# EAGLE schematic p8x-alu-card (EAGLE 9.6.2)
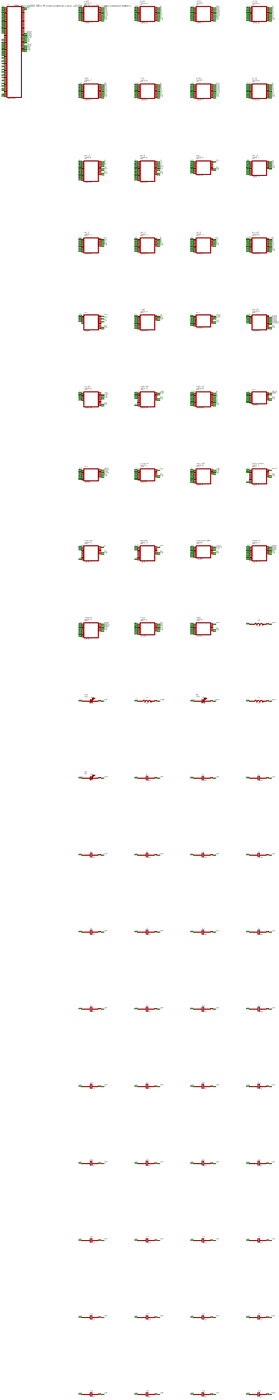
[diagram p0: schematic, sheet 1, overview]
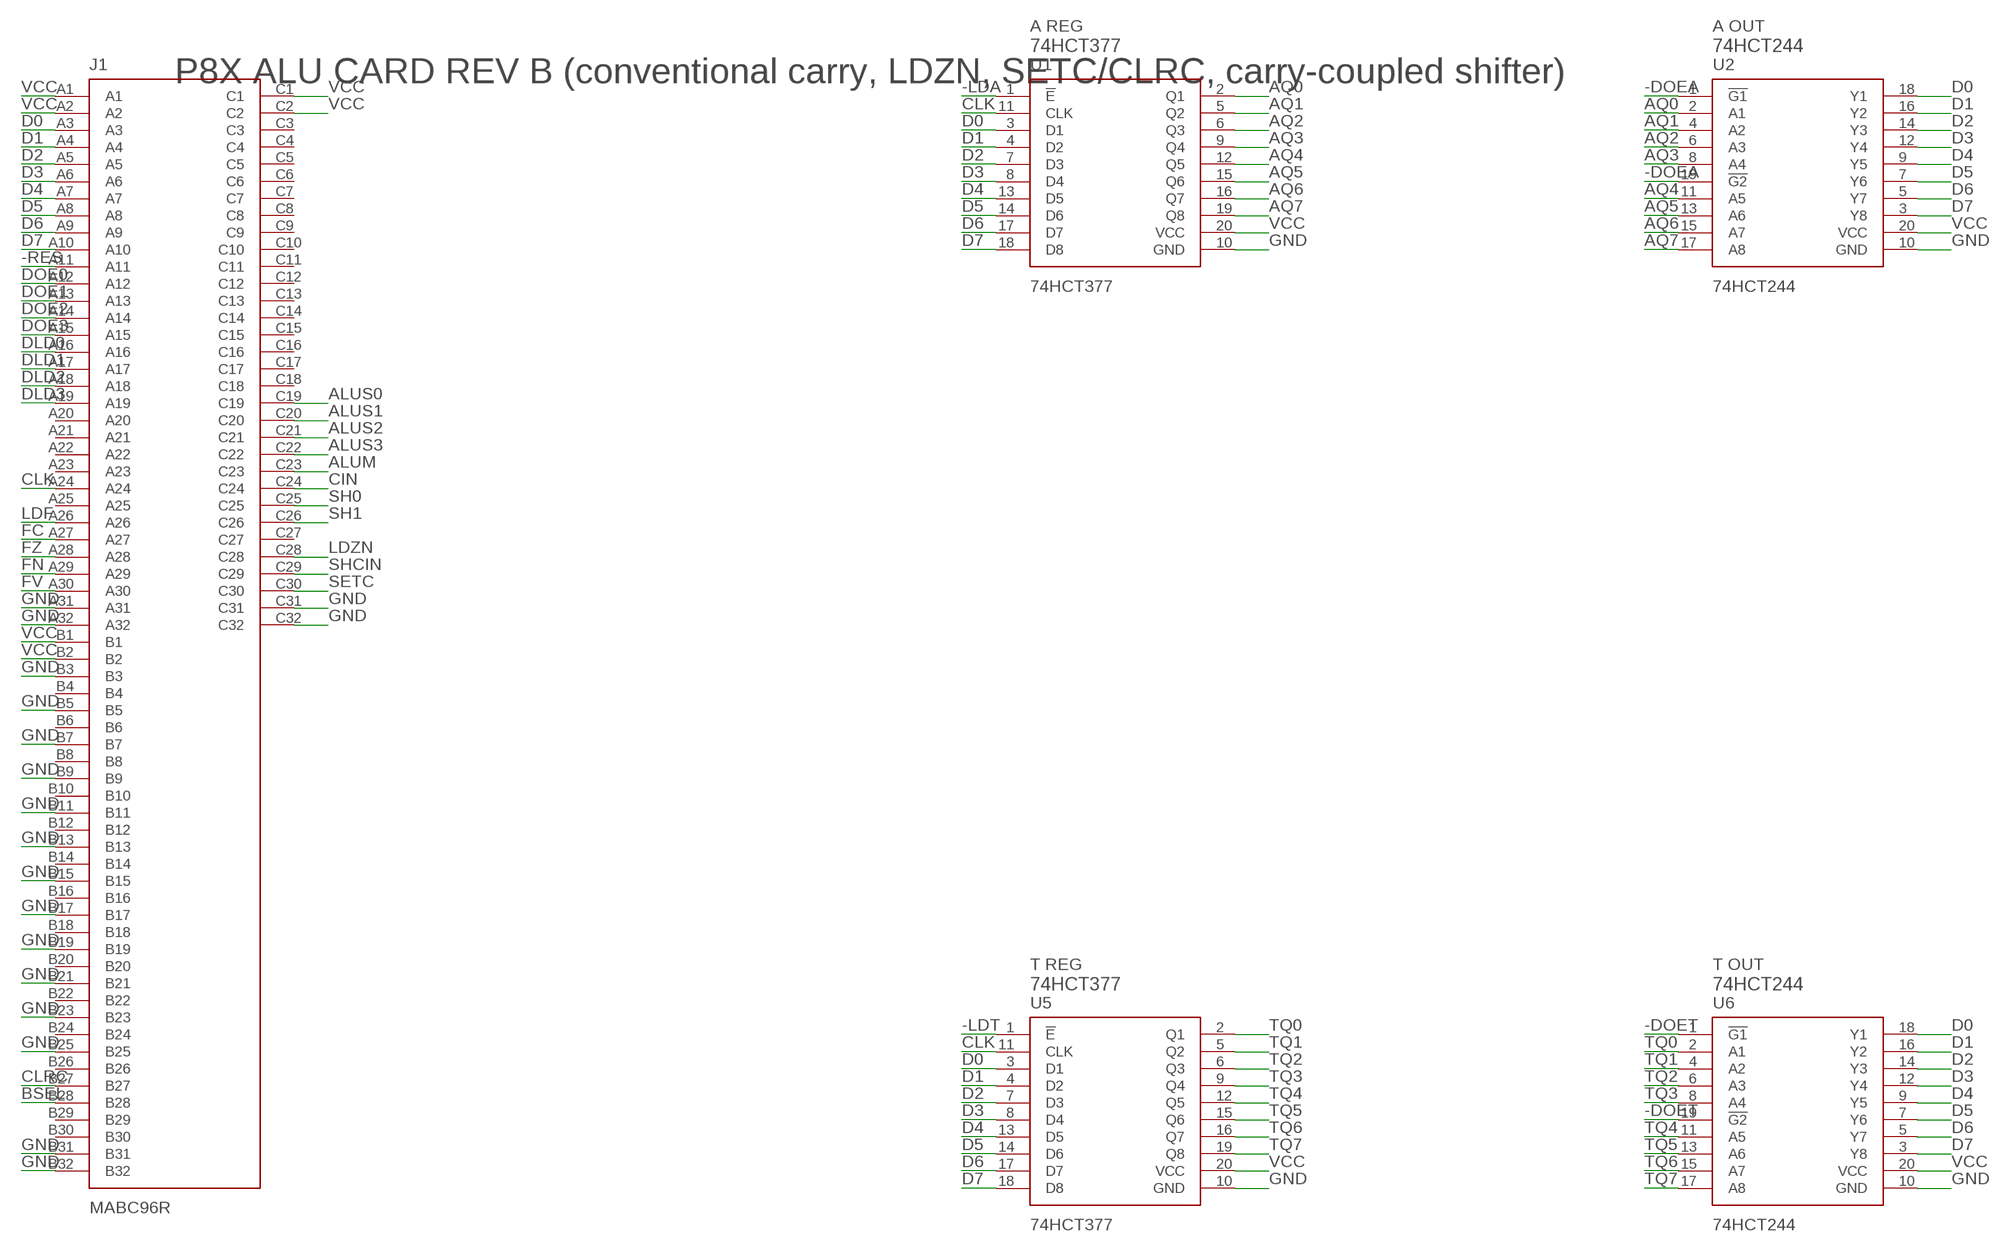
[diagram p1: schematic, sheet 1, part 1 of 8]
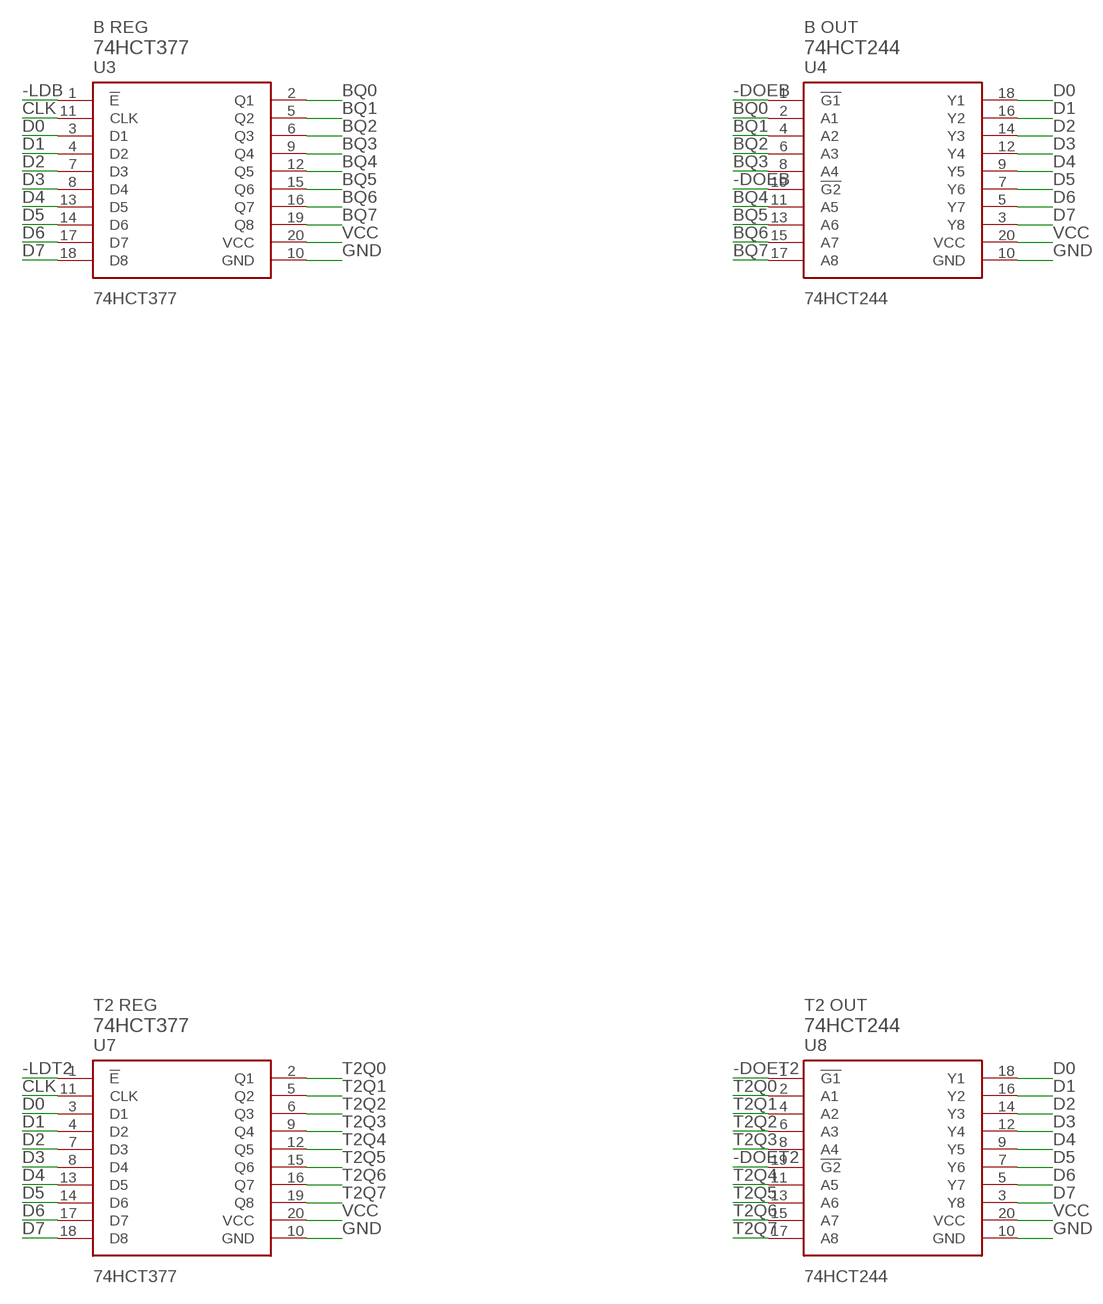
[diagram p2: schematic, sheet 1, part 2 of 8]
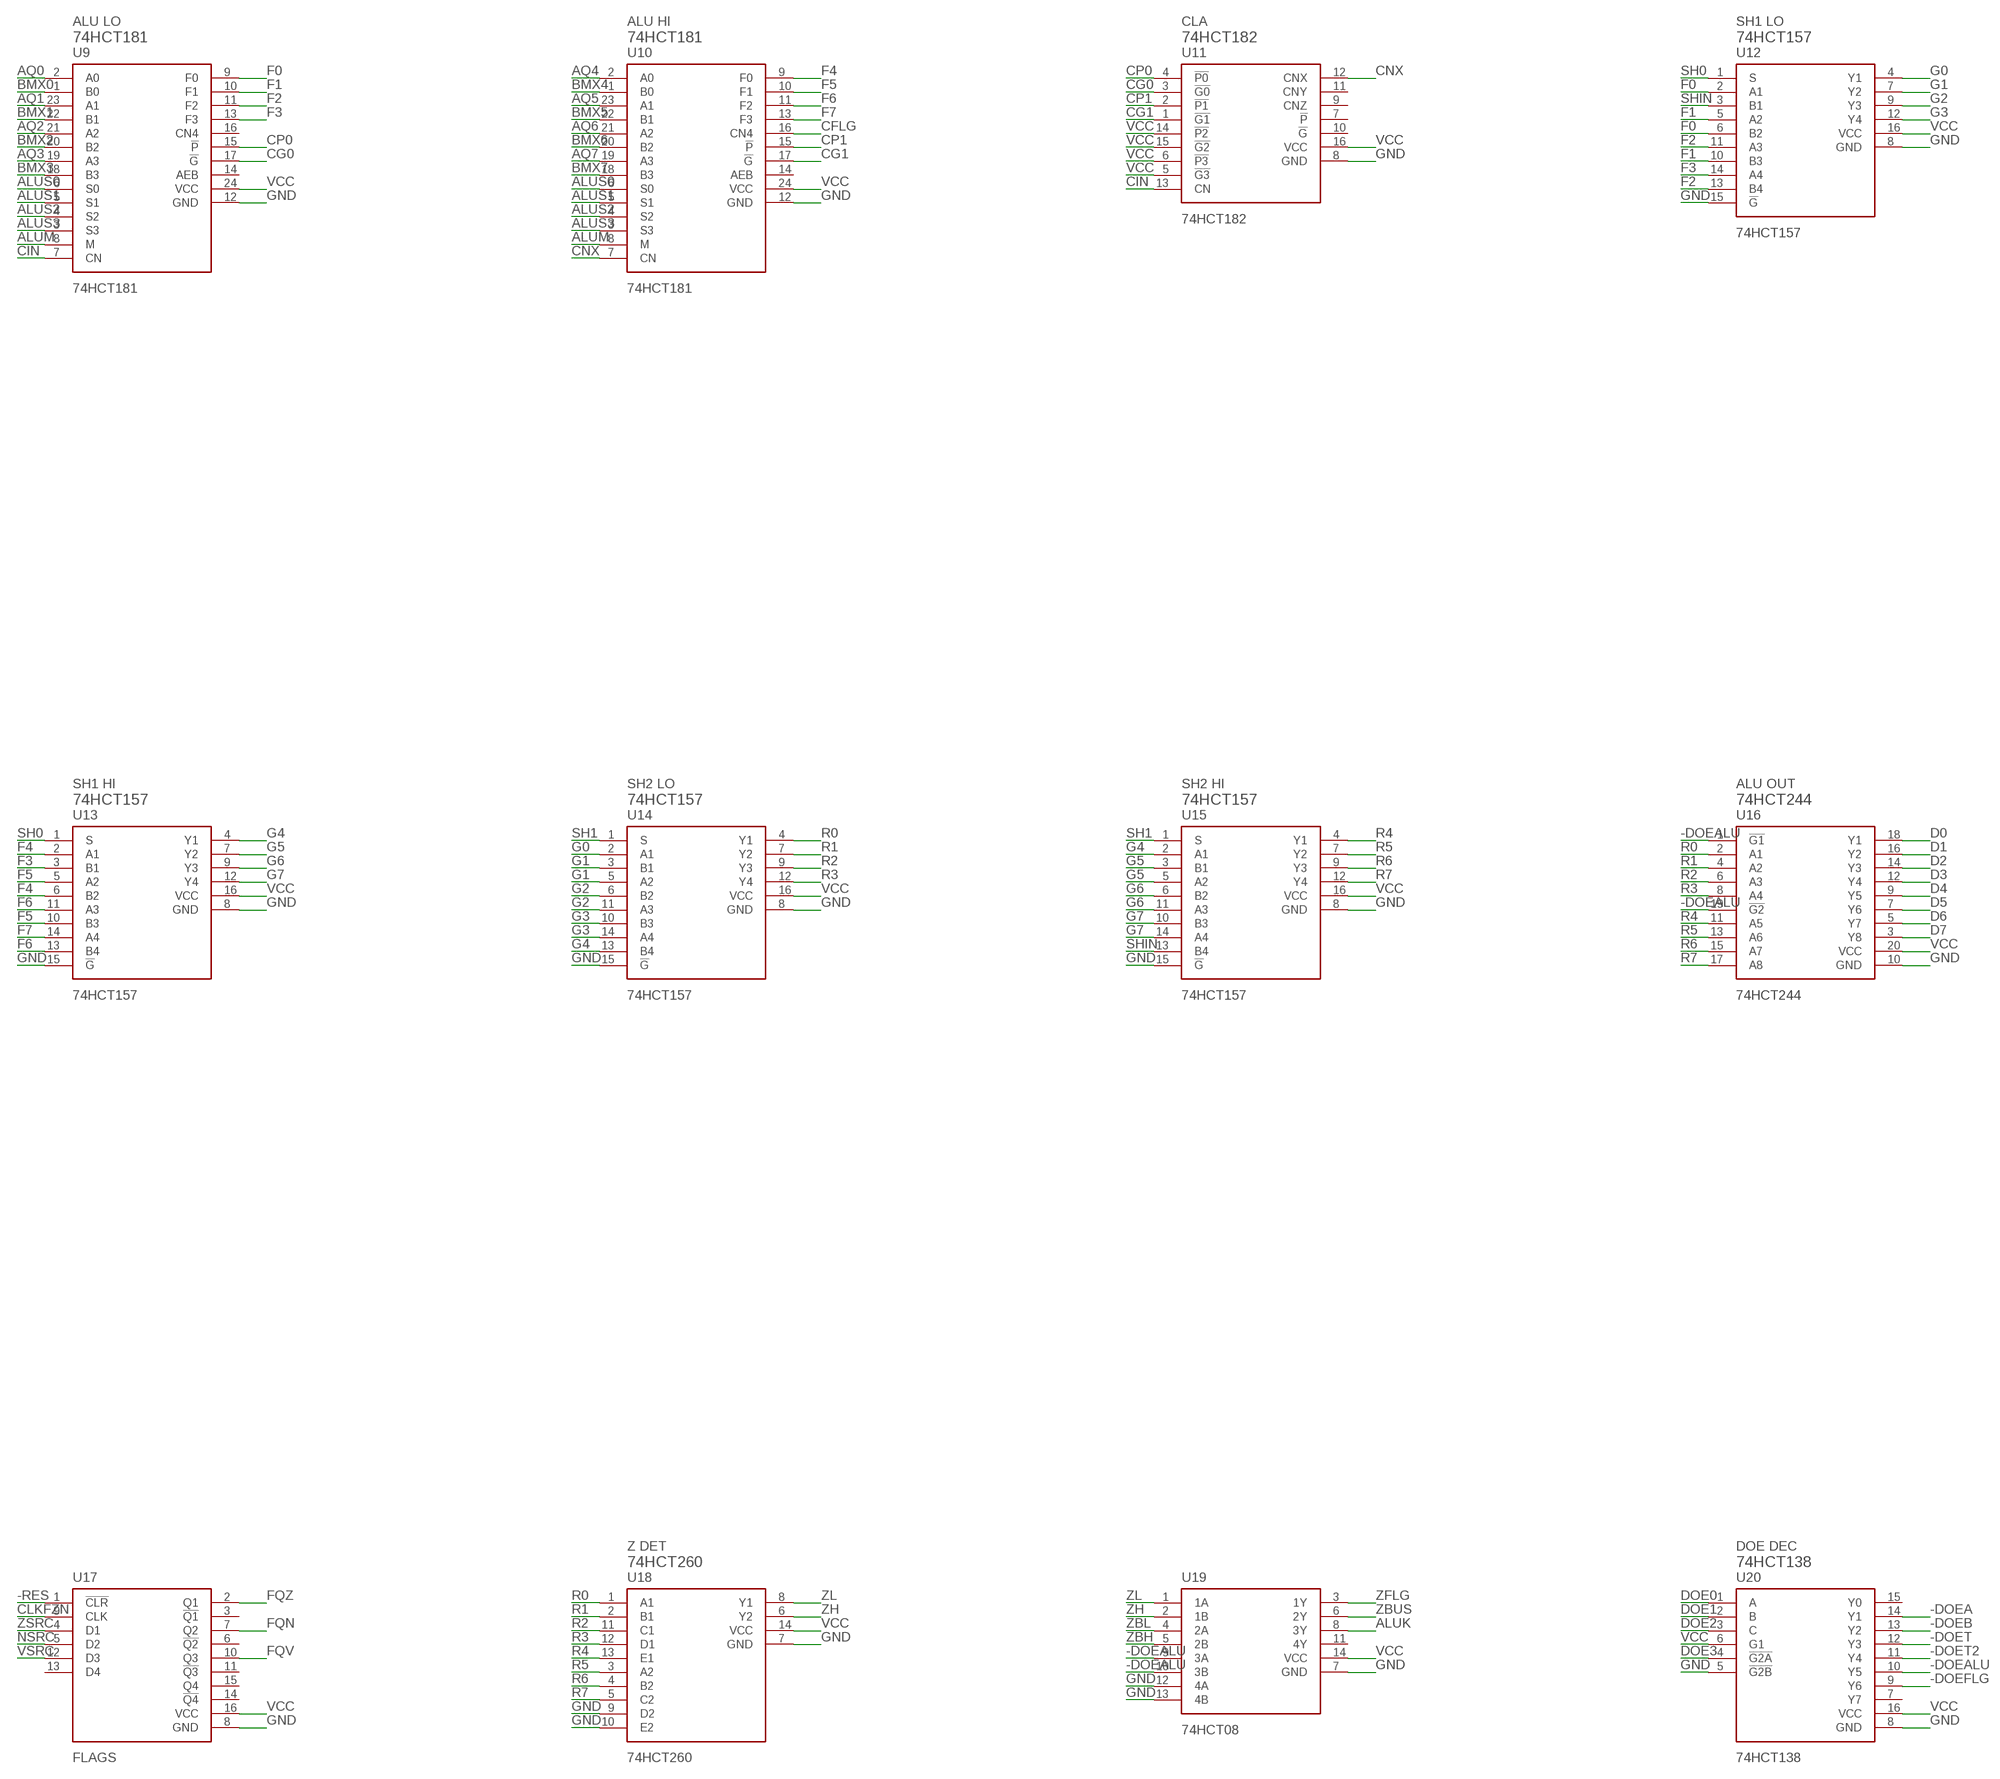
[diagram p3: schematic, sheet 1, part 3 of 8]
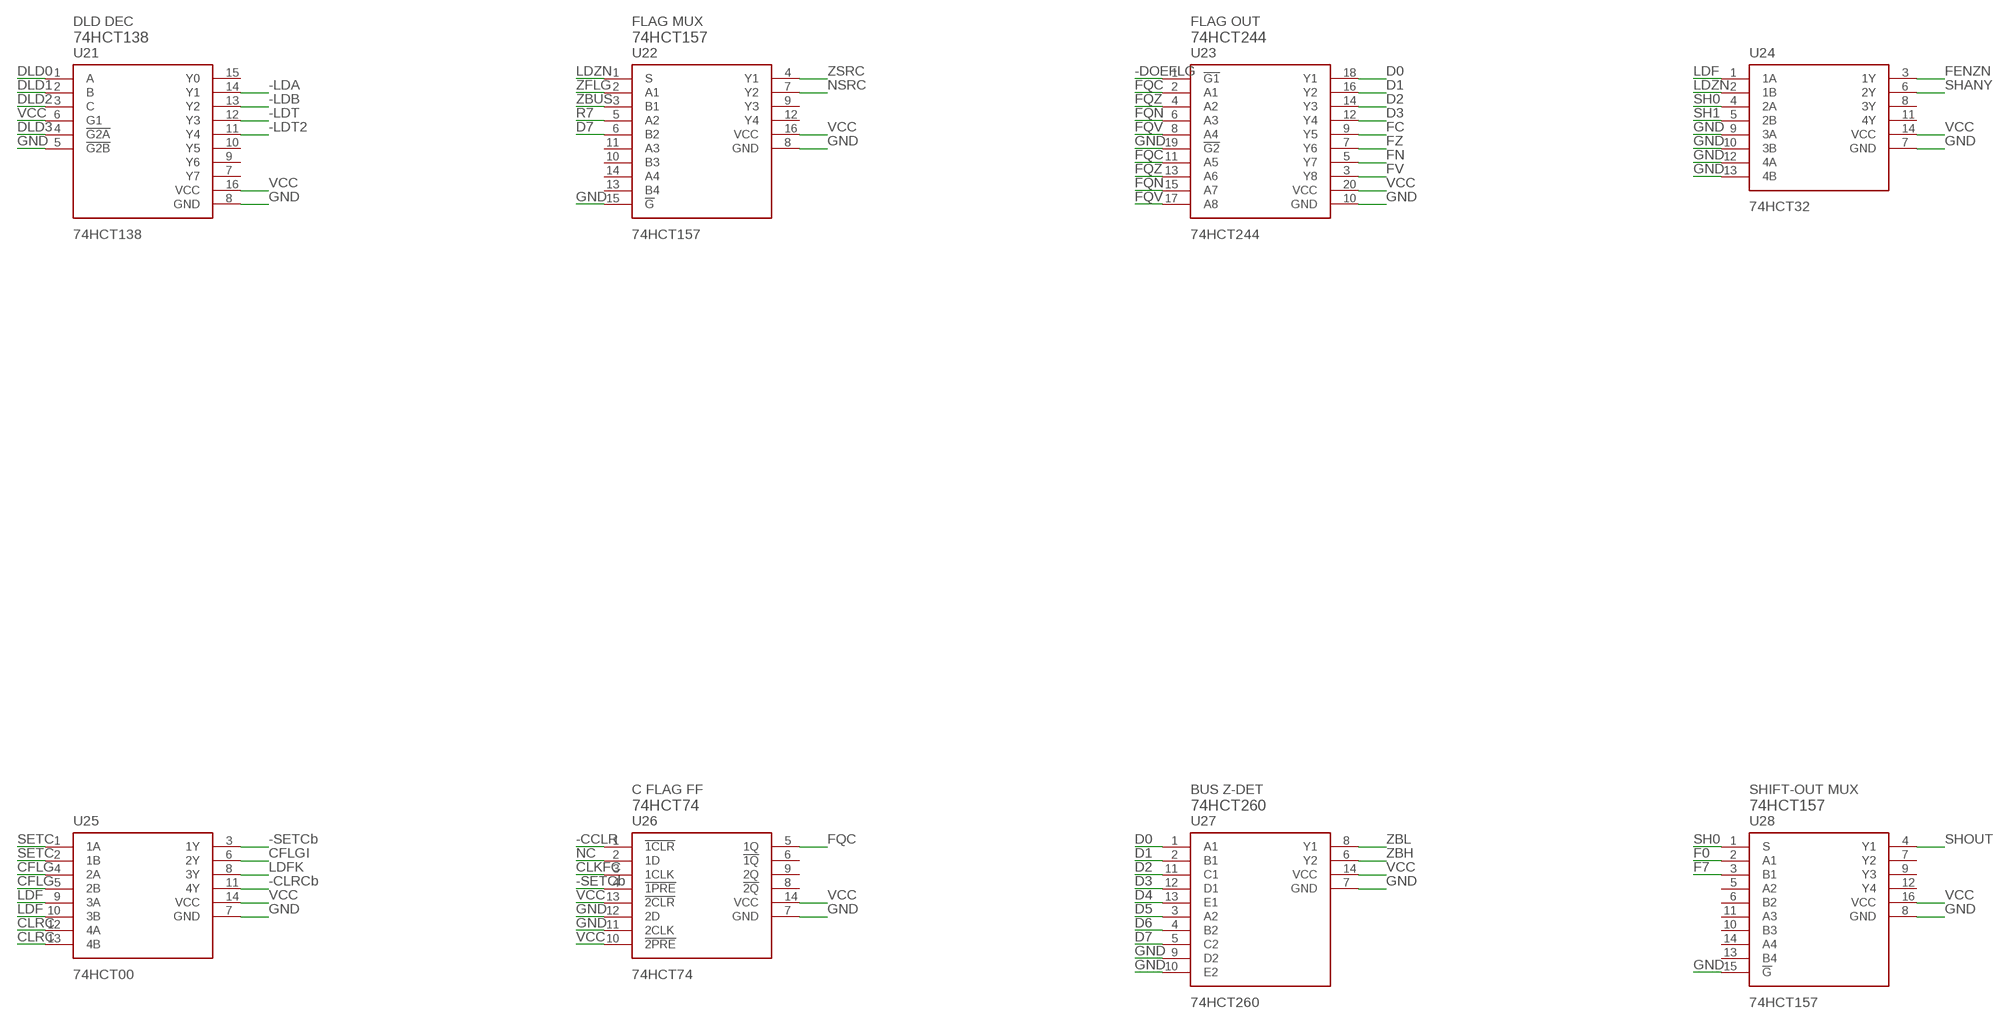
[diagram p4: schematic, sheet 1, part 4 of 8]
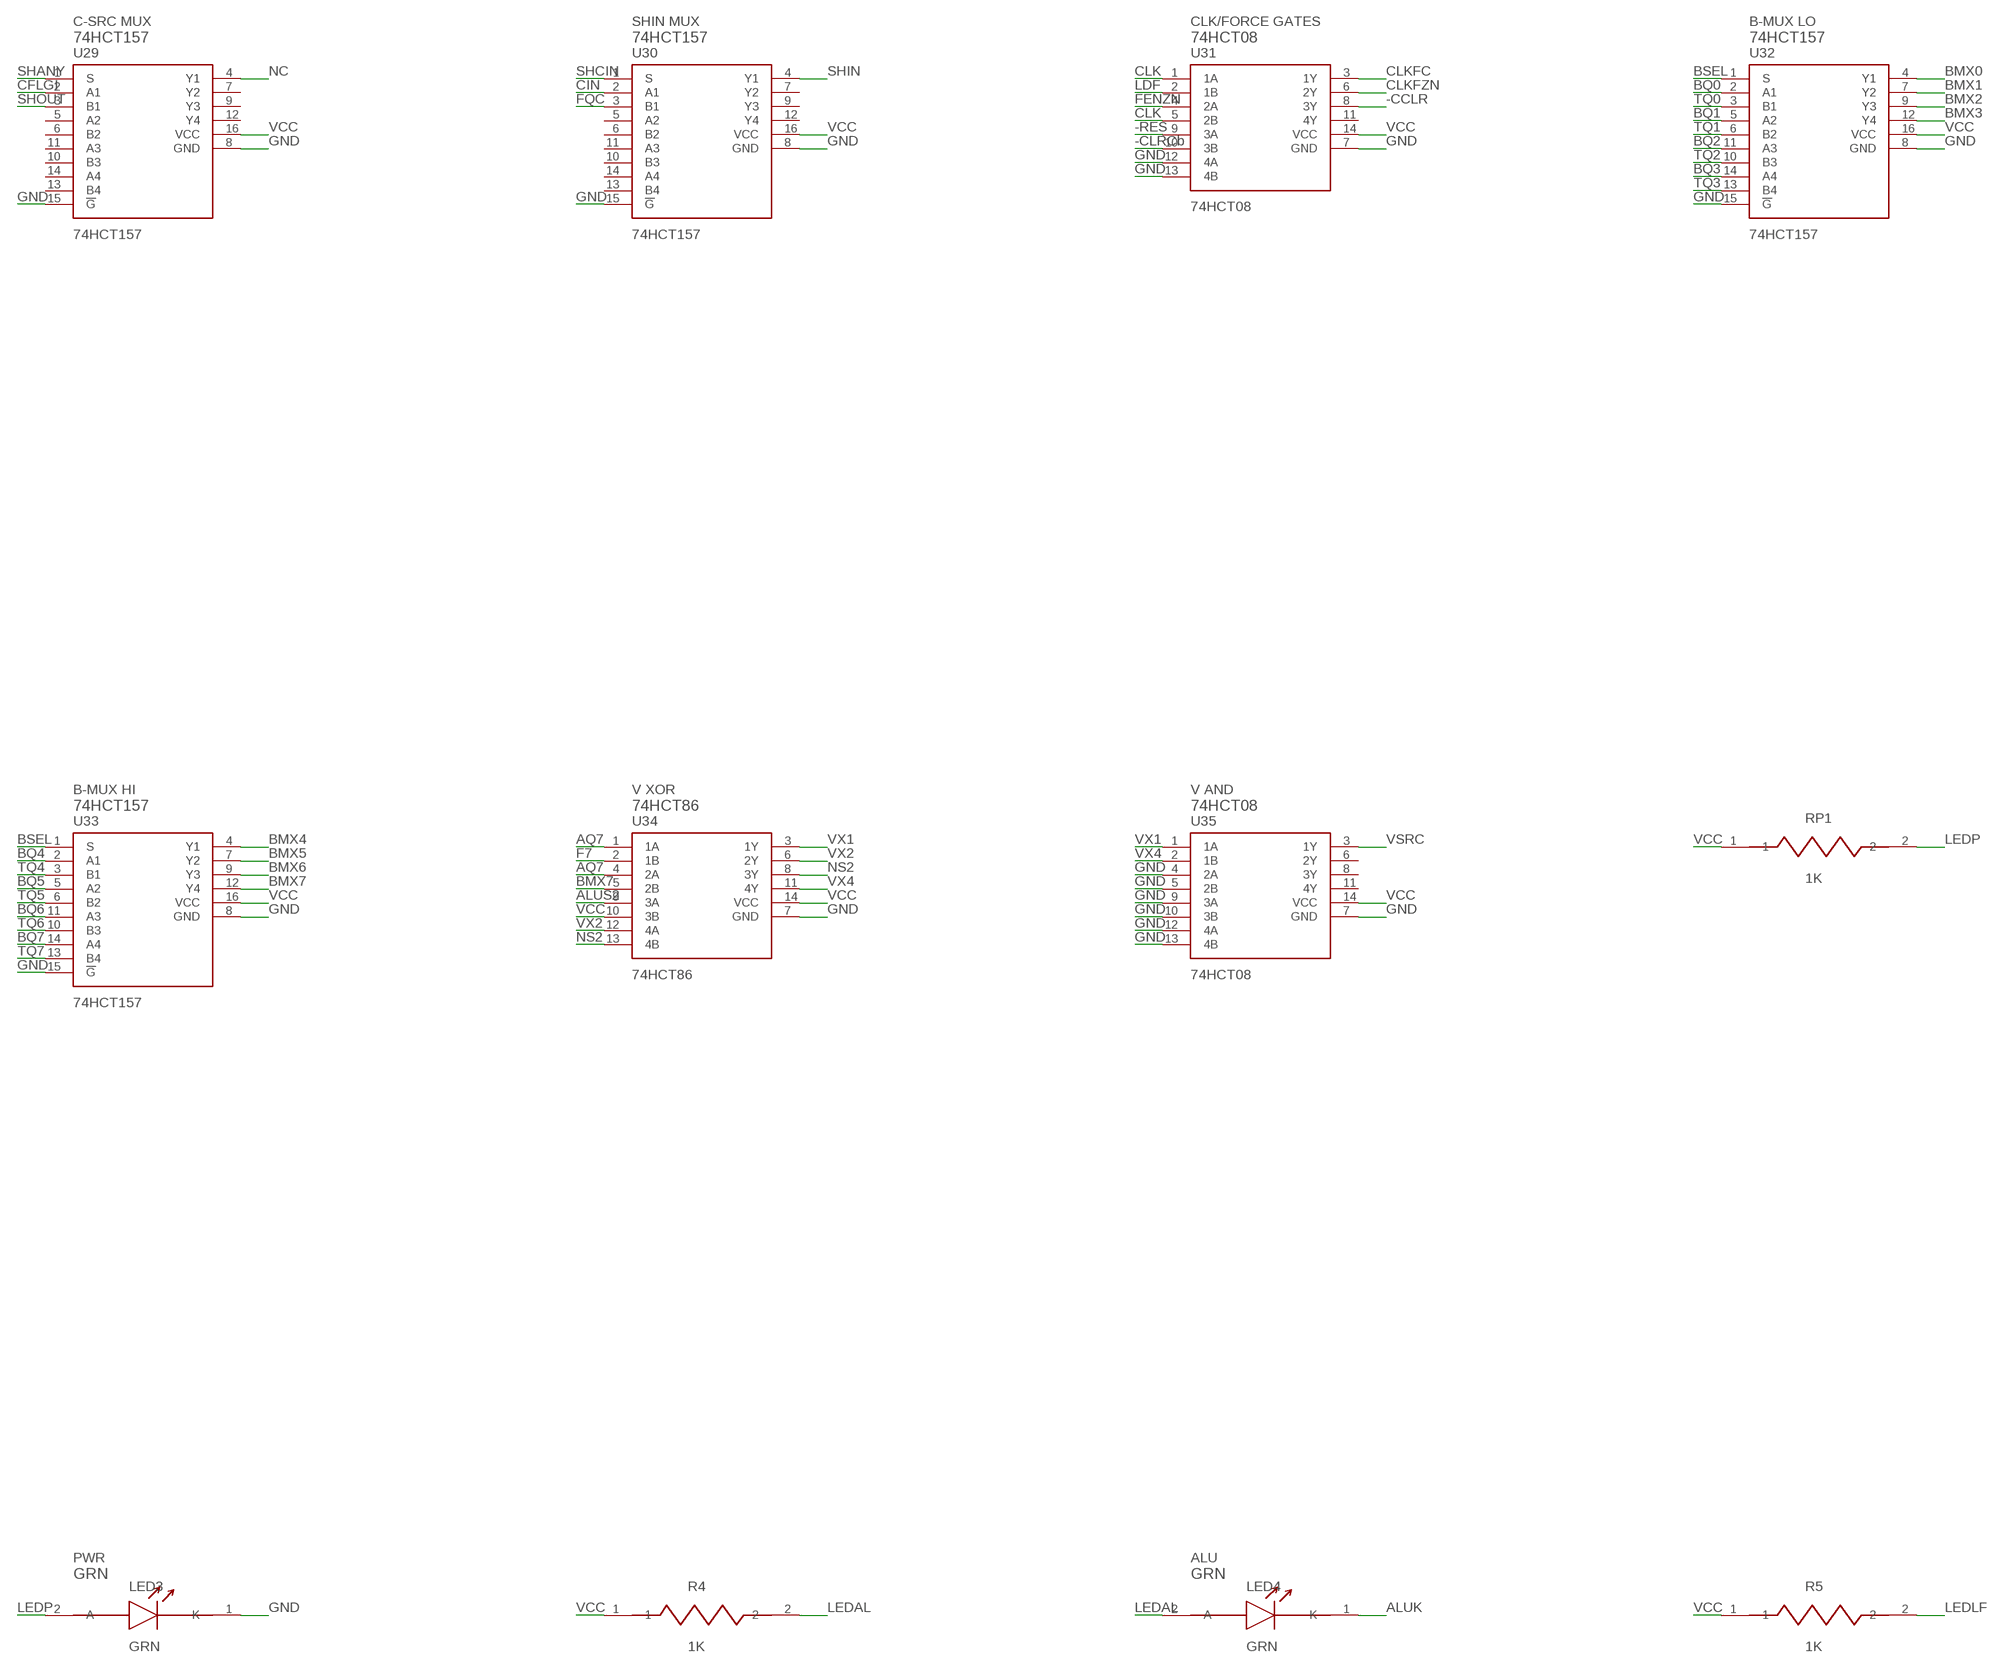
[diagram p5: schematic, sheet 1, part 5 of 8]
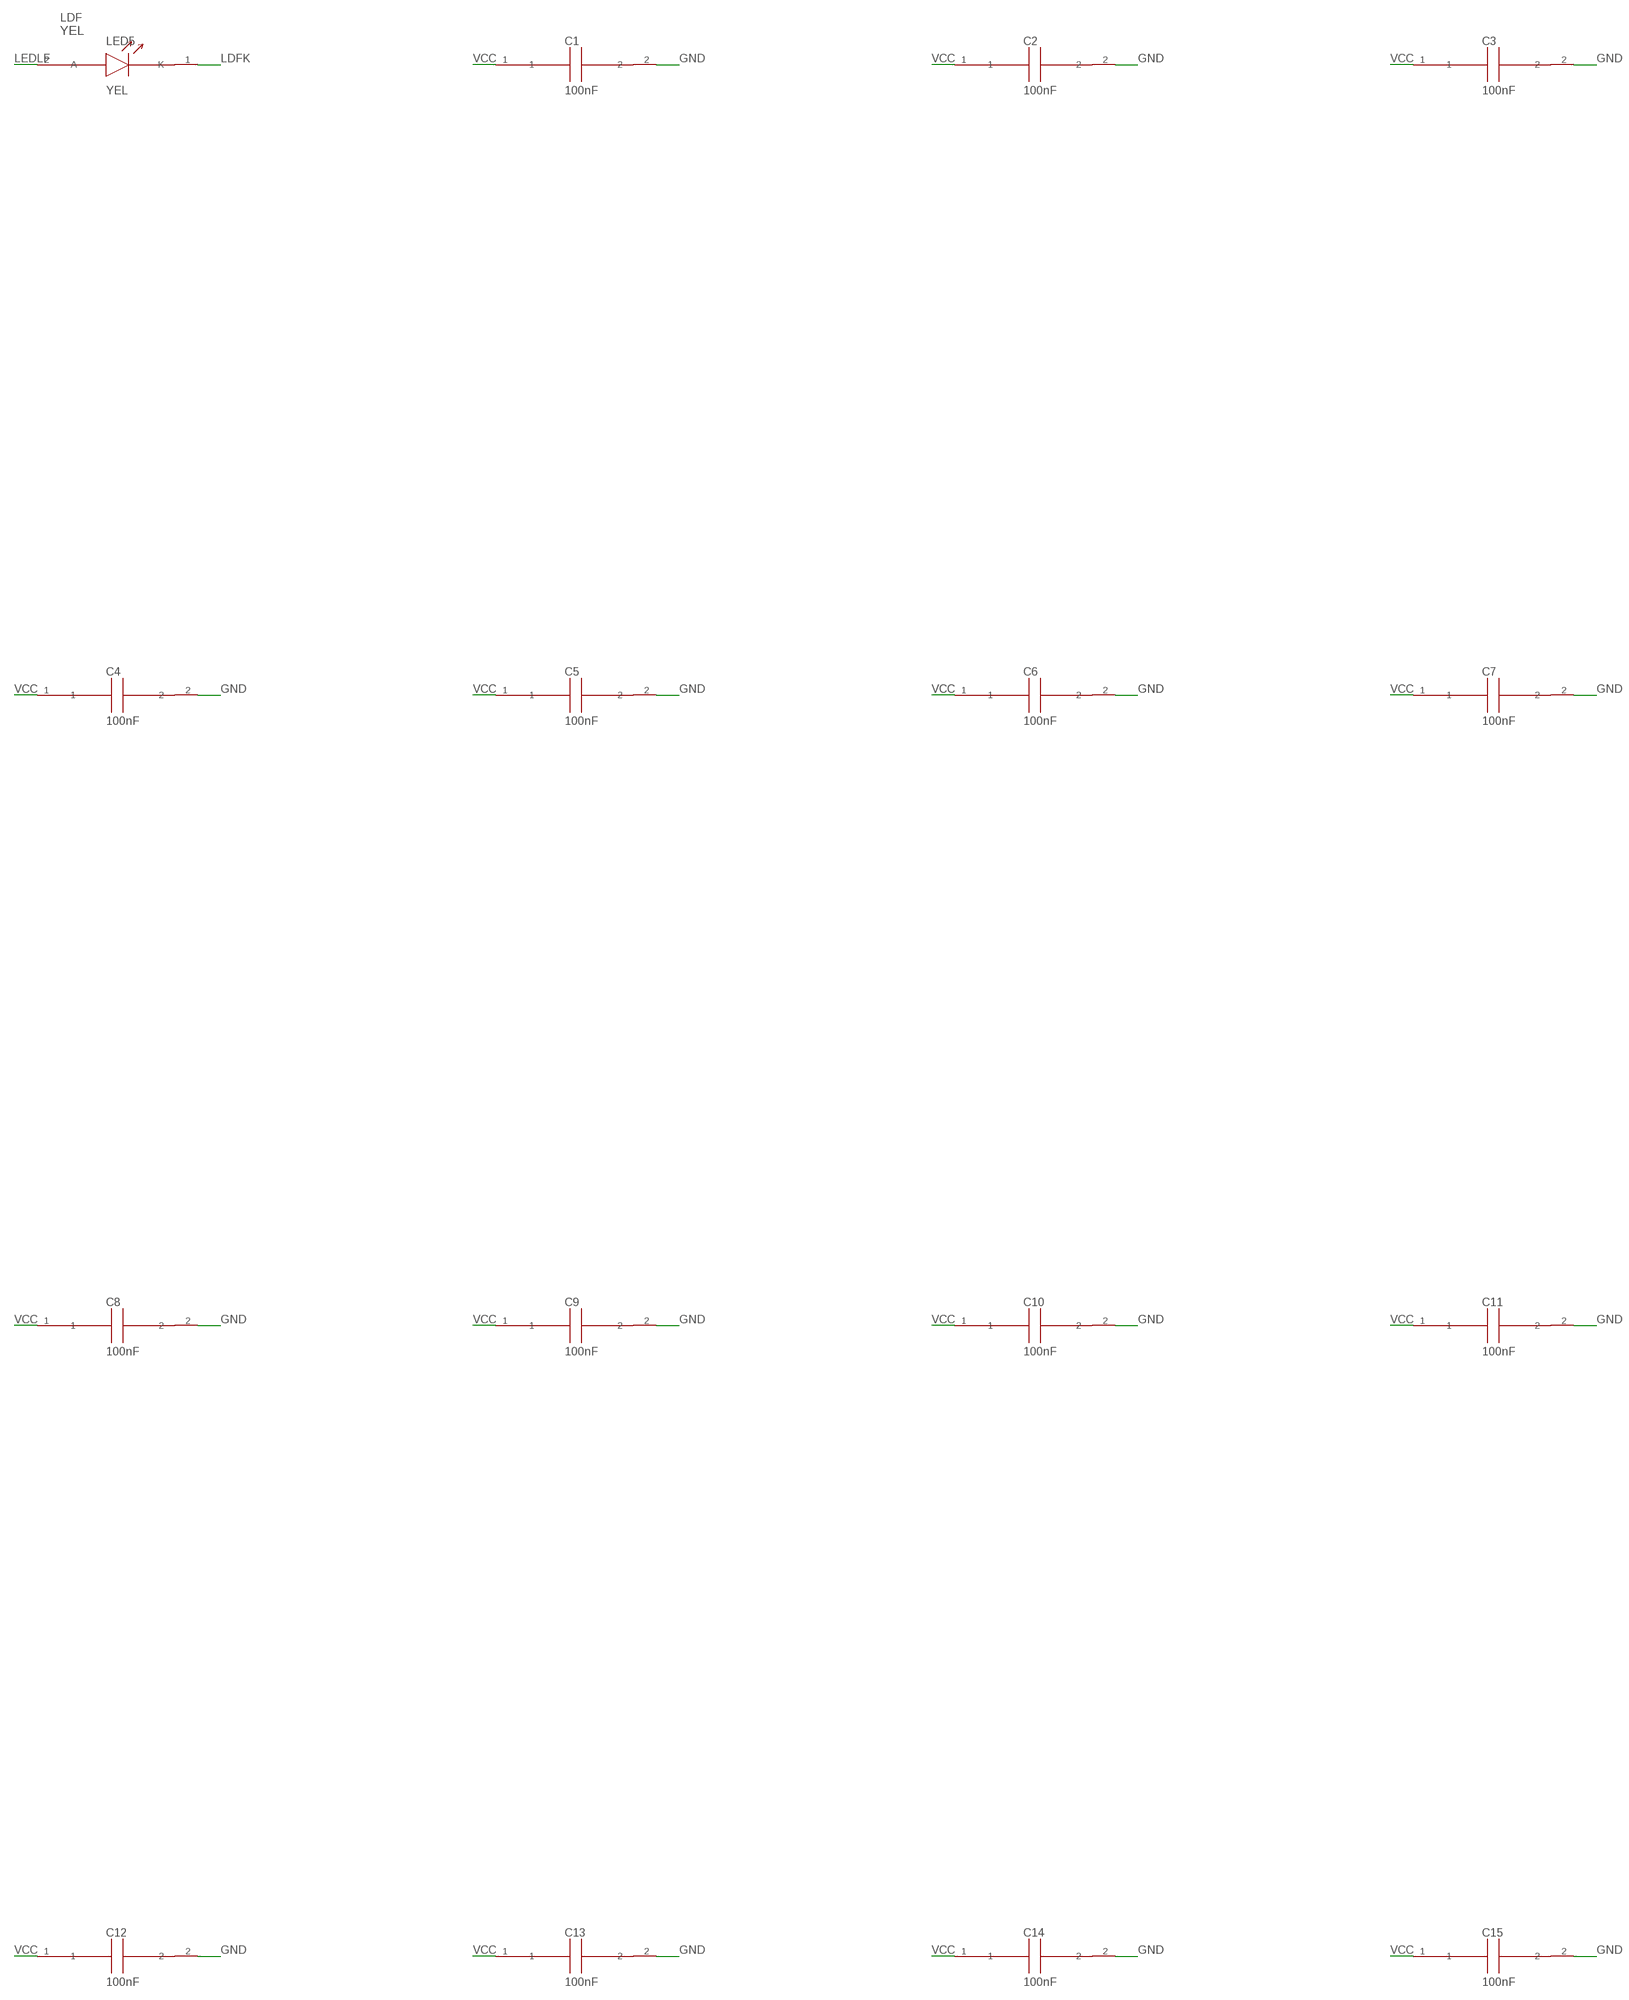
[diagram p6: schematic, sheet 1, part 6 of 8]
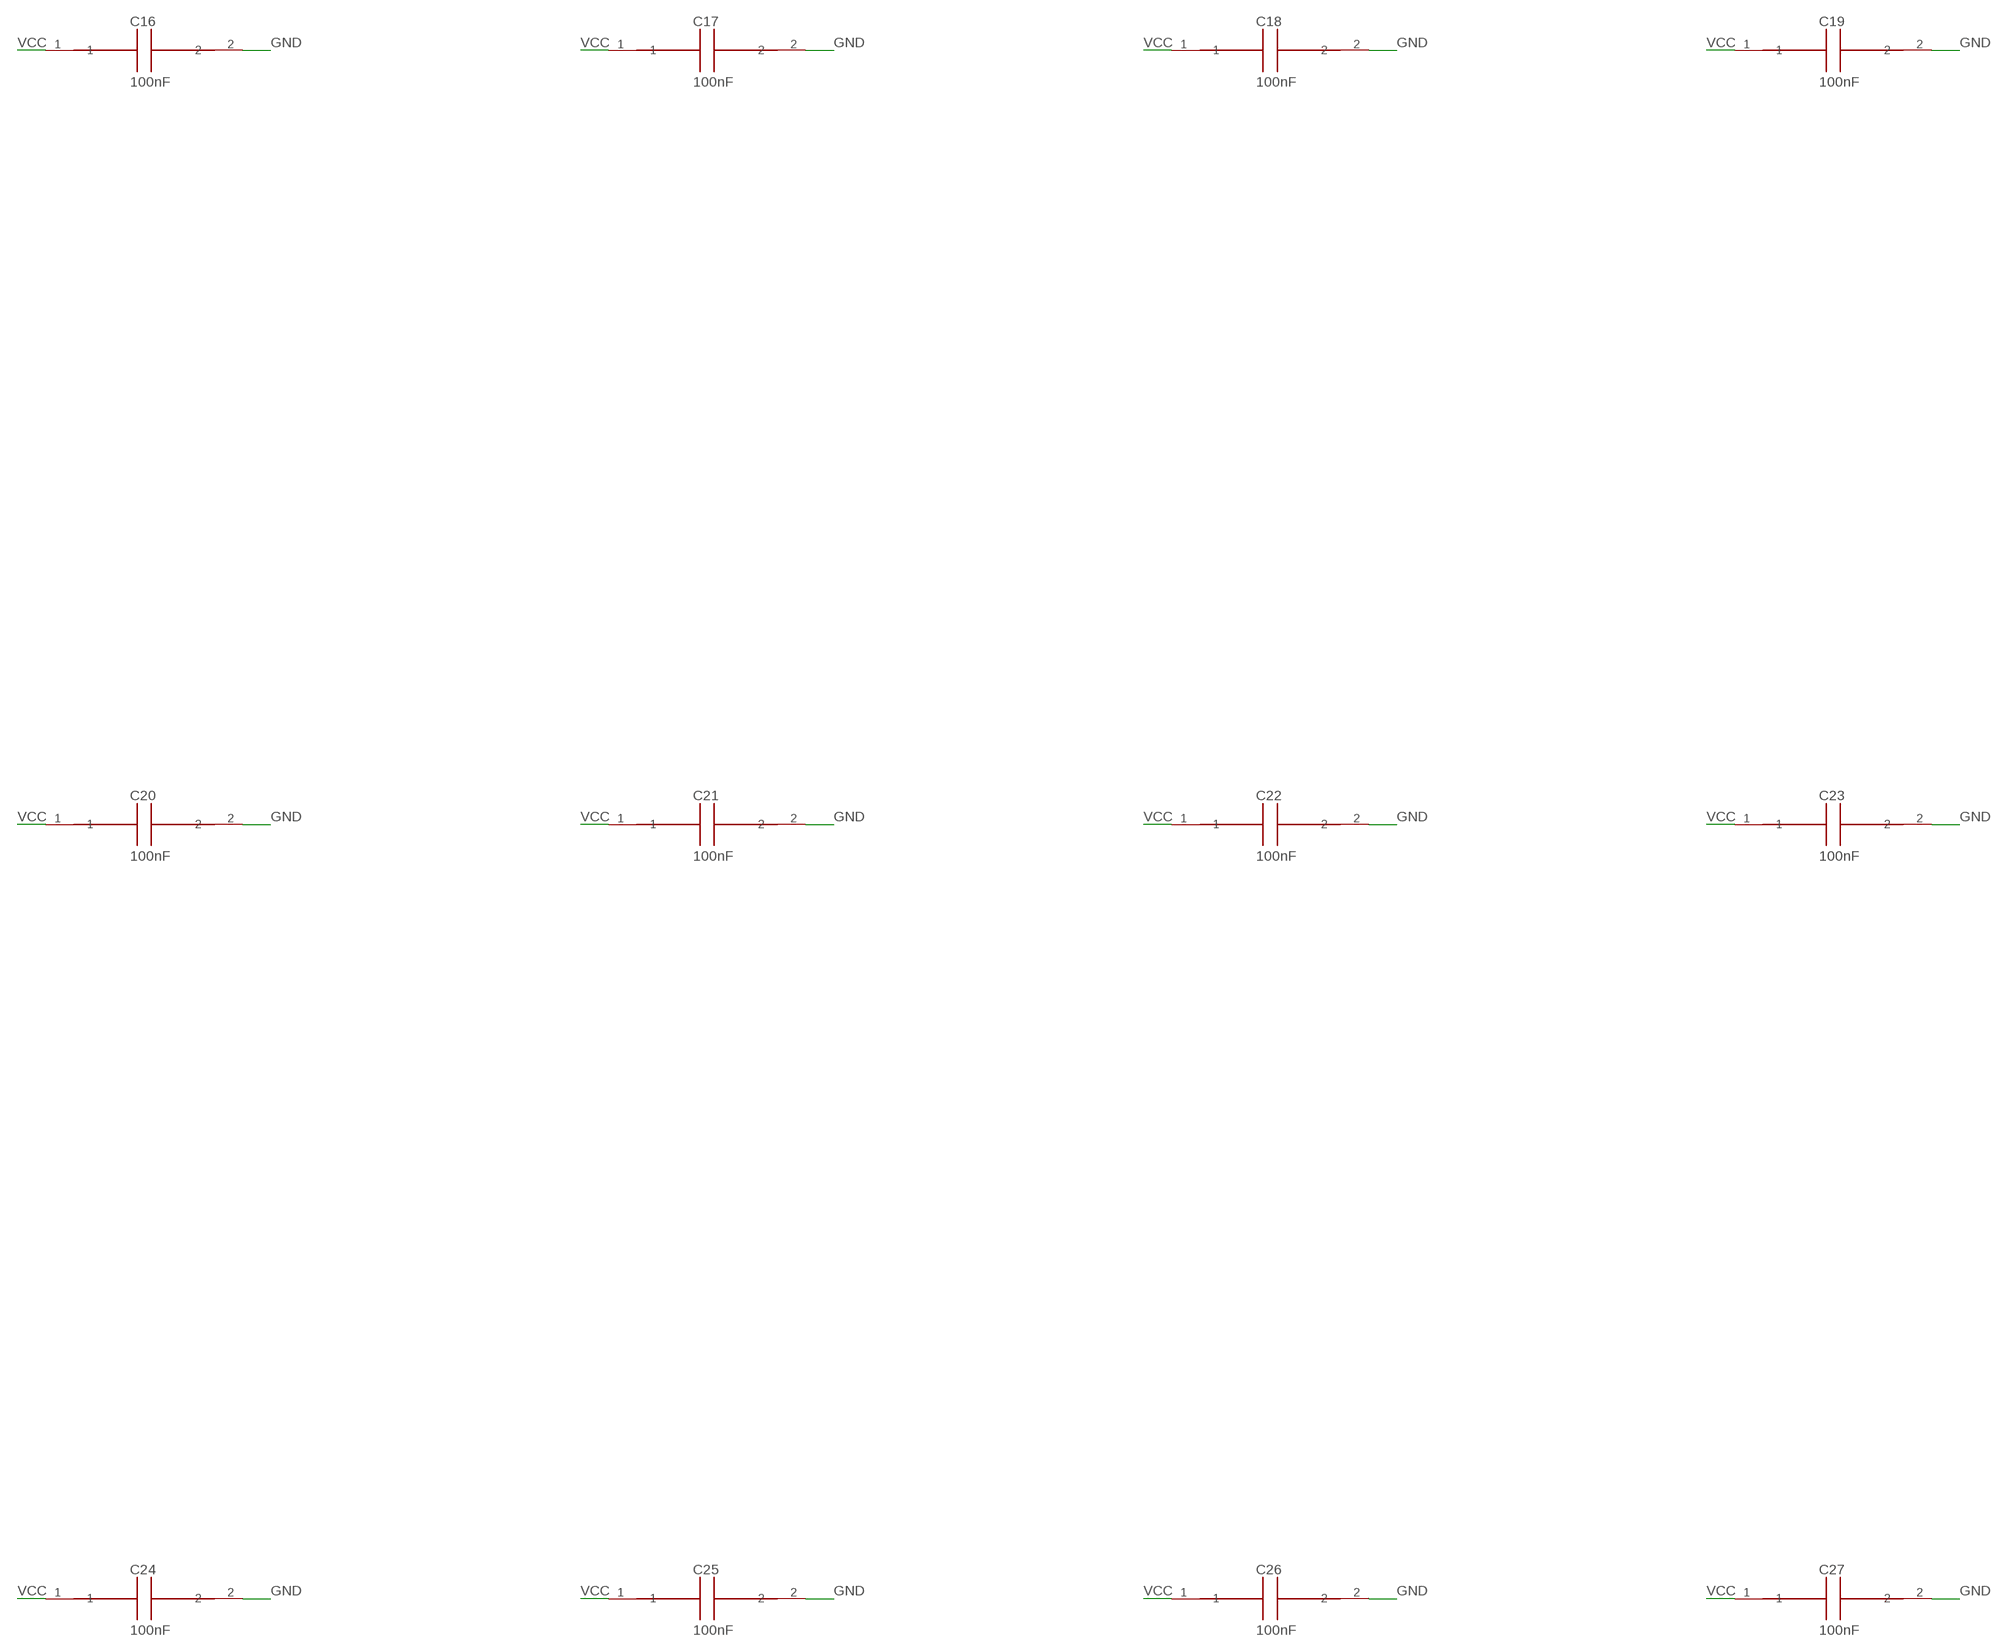
[diagram p7: schematic, sheet 1, part 7 of 8]
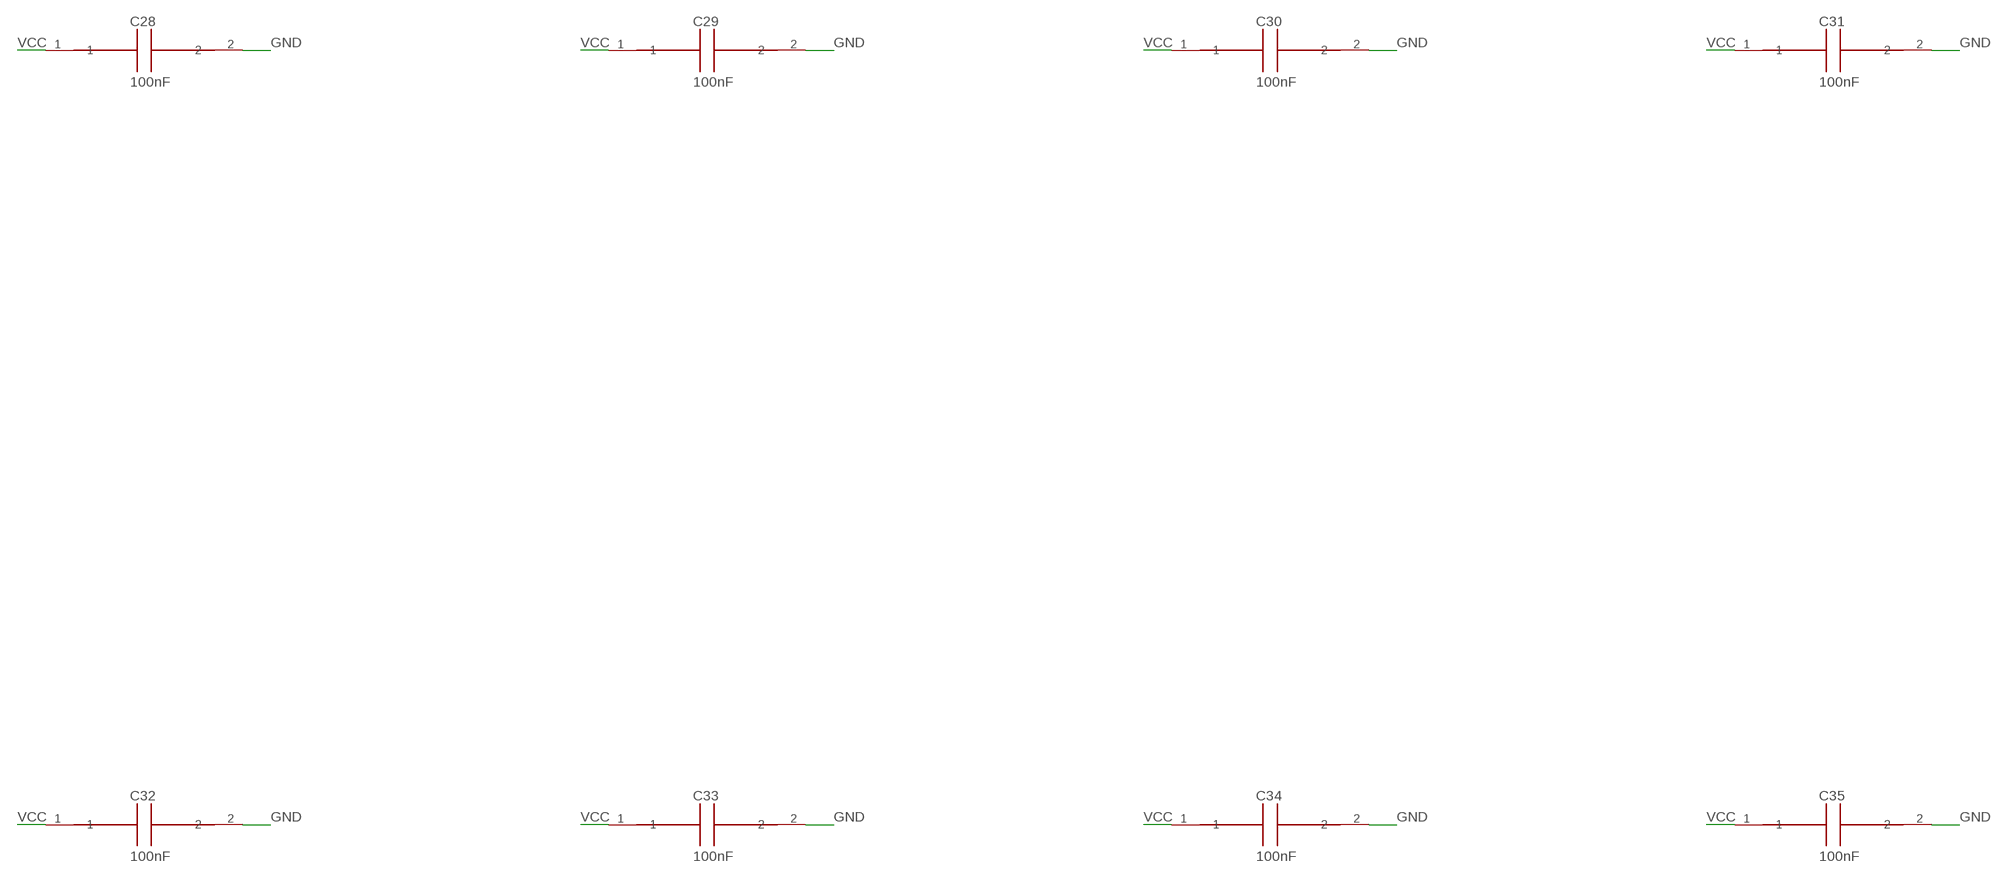
[diagram p8: schematic, sheet 1, part 8 of 8]

## Parts
C1  100nF  CAP1  [C_DISC1]
C2  100nF  CAP1  [C_DISC1]
C3  100nF  CAP1  [C_DISC1]
C4  100nF  CAP1  [C_DISC1]
C5  100nF  CAP1  [C_DISC1]
C6  100nF  CAP1  [C_DISC1]
C7  100nF  CAP1  [C_DISC1]
C8  100nF  CAP1  [C_DISC1]
C9  100nF  CAP1  [C_DISC1]
C10  100nF  CAP1  [C_DISC1]
C11  100nF  CAP1  [C_DISC1]
C12  100nF  CAP1  [C_DISC1]
C13  100nF  CAP1  [C_DISC1]
C14  100nF  CAP1  [C_DISC1]
C15  100nF  CAP1  [C_DISC1]
C16  100nF  CAP1  [C_DISC1]
C17  100nF  CAP1  [C_DISC1]
C18  100nF  CAP1  [C_DISC1]
C19  100nF  CAP1  [C_DISC1]
C20  100nF  CAP1  [C_DISC1]
C21  100nF  CAP1  [C_DISC1]
C22  100nF  CAP1  [C_DISC1]
C23  100nF  CAP1  [C_DISC1]
C24  100nF  CAP1  [C_DISC1]
C25  100nF  CAP1  [C_DISC1]
C26  100nF  CAP1  [C_DISC1]
C27  100nF  CAP1  [C_DISC1]
C28  100nF  CAP1  [C_DISC1]
C29  100nF  CAP1  [C_DISC1]
C30  100nF  CAP1  [C_DISC1]
C31  100nF  CAP1  [C_DISC1]
C32  100nF  CAP1  [C_DISC1]
C33  100nF  CAP1  [C_DISC1]
C34  100nF  CAP1  [C_DISC1]
C35  100nF  CAP1  [C_DISC1]
J1  MABC96R  DIN96C  [MABC96R]
LED3  GRN  LED  [LED5]
LED4  GRN  LED  [LED5]
LED5  YEL  LED  [LED5]
R4  1K  RES  [R_AXIAL]
R5  1K  RES  [R_AXIAL]
RP1  1K  RES  [R_AXIAL]
U1  74HCT377  74377V2  [DIP20]
U2  74HCT244  74244  [DIP20]
U3  74HCT377  74377V2  [DIP20]
U4  74HCT244  74244  [DIP20]
U5  74HCT377  74377V2  [DIP20]
U6  74HCT244  74244  [DIP20]
U7  74HCT377  74377V2  [DIP20]
U8  74HCT244  74244  [DIP20]
U9  74HCT181  74181  [DIP24W]
U10  74HCT181  74181  [DIP24W]
U11  74HCT182  74182  [DIP16]
U12  74HCT157  74157  [DIP16]
U13  74HCT157  74157  [DIP16]
U14  74HCT157  74157  [DIP16]
U15  74HCT157  74157  [DIP16]
U16  74HCT244  74244  [DIP20]
U17  FLAGS  74175  [DIP16]
U18  74HCT260  74260  [DIP14]
U19  74HCT08  GATES14  [DIP14]
U20  74HCT138  74138  [DIP16]
U21  74HCT138  74138  [DIP16]
U22  74HCT157  74157  [DIP16]
U23  74HCT244  74244  [DIP20]
U24  74HCT32  GATES14  [DIP14]
U25  74HCT00  GATES14  [DIP14]
U26  74HCT74  7474  [DIP14]
U27  74HCT260  74260  [DIP14]
U28  74HCT157  74157  [DIP16]
U29  74HCT157  74157  [DIP16]
U30  74HCT157  74157  [DIP16]
U31  74HCT08  GATES14  [DIP14]
U32  74HCT157  74157  [DIP16]
U33  74HCT157  74157  [DIP16]
U34  74HCT86  GATES14  [DIP14]
U35  74HCT08  GATES14  [DIP14]

## Nets
-CCLR: U26.1(!1CLR) U31.8(3Y)
-CLRCb: U25.11(4Y) U31.10(3B)
-DOEA: U2.1(!G1) U2.19(!G2) U20.14(Y1)
-DOEALU: U16.1(!G1) U16.19(!G2) U19.9(3A) U19.10(3B) U20.10(Y5)
-DOEB: U4.1(!G1) U4.19(!G2) U20.13(Y2)
-DOEFLG: U20.9(Y6) U23.1(!G1)
-DOET: U6.1(!G1) U6.19(!G2) U20.12(Y3)
-DOET2: U8.1(!G1) U8.19(!G2) U20.11(Y4)
-LDA: U1.1(!E) U21.14(Y1)
-LDB: U3.1(!E) U21.13(Y2)
-LDT: U5.1(!E) U21.12(Y3)
-LDT2: U7.1(!E) U21.11(Y4)
-RES: J1.A11 U17.1(!CLR) U31.9(3A)
-SETCb: U25.3(1Y) U26.4(!1PRE)
ALUK: LED4.1(K) U19.8(3Y)
ALUM: J1.C23 U9.8(M) U10.8(M)
ALUS0: J1.C19 U9.6(S0) U10.6(S0)
ALUS1: J1.C20 U9.5(S1) U10.5(S1)
ALUS2: J1.C21 U9.4(S2) U10.4(S2) U34.9(3A)
ALUS3: J1.C22 U9.3(S3) U10.3(S3)
AQ0: U1.2(Q1) U2.2(A1) U9.2(A0)
AQ1: U1.5(Q2) U2.4(A2) U9.23(A1)
AQ2: U1.6(Q3) U2.6(A3) U9.21(A2)
AQ3: U1.9(Q4) U2.8(A4) U9.19(A3)
AQ4: U1.12(Q5) U2.11(A5) U10.2(A0)
AQ5: U1.15(Q6) U2.13(A6) U10.23(A1)
AQ6: U1.16(Q7) U2.15(A7) U10.21(A2)
AQ7: U1.19(Q8) U2.17(A8) U10.19(A3) U34.1(1A) U34.4(2A)
BMX0: U9.1(B0) U32.4(Y1)
BMX1: U9.22(B1) U32.7(Y2)
BMX2: U9.20(B2) U32.9(Y3)
BMX3: U9.18(B3) U32.12(Y4)
BMX4: U10.1(B0) U33.4(Y1)
BMX5: U10.22(B1) U33.7(Y2)
BMX6: U10.20(B2) U33.9(Y3)
BMX7: U10.18(B3) U33.12(Y4) U34.5(2B)
BQ0: U3.2(Q1) U4.2(A1) U32.2(A1)
BQ1: U3.5(Q2) U4.4(A2) U32.5(A2)
BQ2: U3.6(Q3) U4.6(A3) U32.11(A3)
BQ3: U3.9(Q4) U4.8(A4) U32.14(A4)
BQ4: U3.12(Q5) U4.11(A5) U33.2(A1)
BQ5: U3.15(Q6) U4.13(A6) U33.5(A2)
BQ6: U3.16(Q7) U4.15(A7) U33.11(A3)
BQ7: U3.19(Q8) U4.17(A8) U33.14(A4)
BSEL: J1.B28 U32.1(S) U33.1(S)
CFLG: U10.16(CN4) U25.4(2A) U25.5(2B)
CFLGI: U25.6(2Y) U29.2(A1)
CG0: U9.17(!G) U11.3(!G0)
CG1: U10.17(!G) U11.1(!G1)
CIN: J1.C24 U9.7(CN) U11.13(CN) U30.2(A1)
CLK: J1.A24 U1.11(CLK) U3.11(CLK) U5.11(CLK) U7.11(CLK) U31.1(1A) U31.5(2B)
CLKFC: U26.3(1CLK) U31.3(1Y)
CLKFZN: U17.9(CLK) U31.6(2Y)
CLRC: J1.B27 U25.12(4A) U25.13(4B)
CNX: U10.7(CN) U11.12(CNX)
CP0: U9.15(!P) U11.4(!P0)
CP1: U10.15(!P) U11.2(!P1)
D0: J1.A3 U1.3(D1) U2.18(Y1) U3.3(D1) U4.18(Y1) U5.3(D1) U6.18(Y1) U7.3(D1) U8.18(Y1) U16.18(Y1) U23.18(Y1) U27.1(A1)
D1: J1.A4 U1.4(D2) U2.16(Y2) U3.4(D2) U4.16(Y2) U5.4(D2) U6.16(Y2) U7.4(D2) U8.16(Y2) U16.16(Y2) U23.16(Y2) U27.2(B1)
D2: J1.A5 U1.7(D3) U2.14(Y3) U3.7(D3) U4.14(Y3) U5.7(D3) U6.14(Y3) U7.7(D3) U8.14(Y3) U16.14(Y3) U23.14(Y3) U27.11(C1)
D3: J1.A6 U1.8(D4) U2.12(Y4) U3.8(D4) U4.12(Y4) U5.8(D4) U6.12(Y4) U7.8(D4) U8.12(Y4) U16.12(Y4) U23.12(Y4) U27.12(D1)
D4: J1.A7 U1.13(D5) U2.9(Y5) U3.13(D5) U4.9(Y5) U5.13(D5) U6.9(Y5) U7.13(D5) U8.9(Y5) U16.9(Y5) U27.13(E1)
D5: J1.A8 U1.14(D6) U2.7(Y6) U3.14(D6) U4.7(Y6) U5.14(D6) U6.7(Y6) U7.14(D6) U8.7(Y6) U16.7(Y6) U27.3(A2)
D6: J1.A9 U1.17(D7) U2.5(Y7) U3.17(D7) U4.5(Y7) U5.17(D7) U6.5(Y7) U7.17(D7) U8.5(Y7) U16.5(Y7) U27.4(B2)
D7: J1.A10 U1.18(D8) U2.3(Y8) U3.18(D8) U4.3(Y8) U5.18(D8) U6.3(Y8) U7.18(D8) U8.3(Y8) U16.3(Y8) U22.6(B2) U27.5(C2)
DLD0: J1.A16 U21.1(A)
DLD1: J1.A17 U21.2(B)
DLD2: J1.A18 U21.3(C)
DLD3: J1.A19 U21.4(!G2A)
DOE0: J1.A12 U20.1(A)
DOE1: J1.A13 U20.2(B)
DOE2: J1.A14 U20.3(C)
DOE3: J1.A15 U20.4(!G2A)
F0: U9.9(F0) U12.2(A1) U12.6(B2) U28.2(A1)
F1: U9.10(F1) U12.5(A2) U12.10(B3)
F2: U9.11(F2) U12.11(A3) U12.13(B4)
F3: U9.13(F3) U12.14(A4) U13.3(B1)
F4: U10.9(F0) U13.2(A1) U13.6(B2)
F5: U10.10(F1) U13.5(A2) U13.10(B3)
F6: U10.11(F2) U13.11(A3) U13.13(B4)
F7: U10.13(F3) U13.14(A4) U28.3(B1) U34.2(1B)
FC: J1.A27 U23.9(Y5)
FENZN: U24.3(1Y) U31.4(2A)
FN: J1.A29 U23.5(Y7)
FQC: U23.2(A1) U23.11(A5) U26.5(1Q) U30.3(B1)
FQN: U17.7(Q2) U23.6(A3) U23.15(A7)
FQV: U17.10(Q3) U23.8(A4) U23.17(A8)
FQZ: U17.2(Q1) U23.4(A2) U23.13(A6)
FV: J1.A30 U23.3(Y8)
FZ: J1.A28 U23.7(Y6)
G0: U12.4(Y1) U14.2(A1)
G1: U12.7(Y2) U14.3(B1) U14.5(A2)
G2: U12.9(Y3) U14.6(B2) U14.11(A3)
G3: U12.12(Y4) U14.10(B3) U14.14(A4)
G4: U13.4(Y1) U14.13(B4) U15.2(A1)
G5: U13.7(Y2) U15.3(B1) U15.5(A2)
G6: U13.9(Y3) U15.6(B2) U15.11(A3)
G7: U13.12(Y4) U15.10(B3) U15.14(A4)
GND: C1.2 C2.2 C3.2 C4.2 C5.2 C6.2 C7.2 C8.2 C9.2 C10.2 C11.2 C12.2 C13.2 C14.2 C15.2 C16.2 C17.2 C18.2 C19.2 C20.2 C21.2 C22.2 C23.2 C24.2 C25.2 C26.2 C27.2 C28.2 C29.2 C30.2 C31.2 C32.2 C33.2 C34.2 C35.2 J1.A31 J1.A32 J1.B3 J1.B5 J1.B7 J1.B9 J1.B11 J1.B13 J1.B15 J1.B17 J1.B19 J1.B21 J1.B23 J1.B25 J1.B31 J1.B32 J1.C31 J1.C32 LED3.1(K) U1.10(GND) U2.10(GND) U3.10(GND) U4.10(GND) U5.10(GND) U6.10(GND) U7.10(GND) U8.10(GND) U9.12(GND) U10.12(GND) U11.8(GND) U12.8(GND) U12.15(!G) U13.8(GND) U13.15(!G) U14.8(GND) U14.15(!G) U15.8(GND) U15.15(!G) U16.10(GND) U17.8(GND) U18.7(GND) U18.9(D2) U18.10(E2) U19.7(GND) U19.12(4A) U19.13(4B) U20.5(!G2B) U20.8(GND) U21.5(!G2B) U21.8(GND) U22.8(GND) U22.15(!G) U23.10(GND) U23.19(!G2) U24.7(GND) U24.9(3A) U24.10(3B) U24.12(4A) U24.13(4B) U25.7(GND) U26.7(GND) U26.11(2CLK) U26.12(2D) U27.7(GND) U27.9(D2) U27.10(E2) U28.8(GND) U28.15(!G) U29.8(GND) U29.15(!G) U30.8(GND) U30.15(!G) U31.7(GND) U31.12(4A) U31.13(4B) U32.8(GND) U32.15(!G) U33.8(GND) U33.15(!G) U34.7(GND) U35.4(2A) U35.5(2B) U35.7(GND) U35.9(3A) U35.10(3B) U35.12(4A) U35.13(4B)
LDF: J1.A26 U24.1(1A) U25.9(3A) U25.10(3B) U31.2(1B)
LDFK: LED5.1(K) U25.8(3Y)
LDZN: J1.C28 U22.1(S) U24.2(1B)
LEDAL: LED4.2(A) R4.2
LEDLF: LED5.2(A) R5.2
LEDP: LED3.2(A) RP1.2
NC: U26.2(1D) U29.4(Y1)
NS2: U34.8(3Y) U34.13(4B)
NSRC: U17.5(D2) U22.7(Y2)
R0: U14.4(Y1) U16.2(A1) U18.1(A1)
R1: U14.7(Y2) U16.4(A2) U18.2(B1)
R2: U14.9(Y3) U16.6(A3) U18.11(C1)
R3: U14.12(Y4) U16.8(A4) U18.12(D1)
R4: U15.4(Y1) U16.11(A5) U18.13(E1)
R5: U15.7(Y2) U16.13(A6) U18.3(A2)
R6: U15.9(Y3) U16.15(A7) U18.4(B2)
R7: U15.12(Y4) U16.17(A8) U18.5(C2) U22.5(A2)
SETC: J1.C30 U25.1(1A) U25.2(1B)
SH0: J1.C25 U12.1(S) U13.1(S) U24.4(2A) U28.1(S)
SH1: J1.C26 U14.1(S) U15.1(S) U24.5(2B)
SHANY: U24.6(2Y) U29.1(S)
SHCIN: J1.C29 U30.1(S)
SHIN: U12.3(B1) U15.13(B4) U30.4(Y1)
SHOUT: U28.4(Y1) U29.3(B1)
T2Q0: U7.2(Q1) U8.2(A1)
T2Q1: U7.5(Q2) U8.4(A2)
T2Q2: U7.6(Q3) U8.6(A3)
T2Q3: U7.9(Q4) U8.8(A4)
T2Q4: U7.12(Q5) U8.11(A5)
T2Q5: U7.15(Q6) U8.13(A6)
T2Q6: U7.16(Q7) U8.15(A7)
T2Q7: U7.19(Q8) U8.17(A8)
TQ0: U5.2(Q1) U6.2(A1) U32.3(B1)
TQ1: U5.5(Q2) U6.4(A2) U32.6(B2)
TQ2: U5.6(Q3) U6.6(A3) U32.10(B3)
TQ3: U5.9(Q4) U6.8(A4) U32.13(B4)
TQ4: U5.12(Q5) U6.11(A5) U33.3(B1)
TQ5: U5.15(Q6) U6.13(A6) U33.6(B2)
TQ6: U5.16(Q7) U6.15(A7) U33.10(B3)
TQ7: U5.19(Q8) U6.17(A8) U33.13(B4)
VCC: C1.1 C2.1 C3.1 C4.1 C5.1 C6.1 C7.1 C8.1 C9.1 C10.1 C11.1 C12.1 C13.1 C14.1 C15.1 C16.1 C17.1 C18.1 C19.1 C20.1 C21.1 C22.1 C23.1 C24.1 C25.1 C26.1 C27.1 C28.1 C29.1 C30.1 C31.1 C32.1 C33.1 C34.1 C35.1 J1.A1 J1.A2 J1.B1 J1.B2 J1.C1 J1.C2 R4.1 R5.1 RP1.1 U1.20(VCC) U2.20(VCC) U3.20(VCC) U4.20(VCC) U5.20(VCC) U6.20(VCC) U7.20(VCC) U8.20(VCC) U9.24(VCC) U10.24(VCC) U11.5(!G3) U11.6(!P3) U11.14(!P2) U11.15(!G2) U11.16(VCC) U12.16(VCC) U13.16(VCC) U14.16(VCC) U15.16(VCC) U16.20(VCC) U17.16(VCC) U18.14(VCC) U19.14(VCC) U20.6(G1) U20.16(VCC) U21.6(G1) U21.16(VCC) U22.16(VCC) U23.20(VCC) U24.14(VCC) U25.14(VCC) U26.10(!2PRE) U26.13(!2CLR) U26.14(VCC) U27.14(VCC) U28.16(VCC) U29.16(VCC) U30.16(VCC) U31.14(VCC) U32.16(VCC) U33.16(VCC) U34.10(3B) U34.14(VCC) U35.14(VCC)
VSRC: U17.12(D3) U35.3(1Y)
VX1: U34.3(1Y) U35.1(1A)
VX2: U34.6(2Y) U34.12(4A)
VX4: U34.11(4Y) U35.2(1B)
ZBH: U19.5(2B) U27.6(Y2)
ZBL: U19.4(2A) U27.8(Y1)
ZBUS: U19.6(2Y) U22.3(B1)
ZFLG: U19.3(1Y) U22.2(A1)
ZH: U18.6(Y2) U19.2(1B)
ZL: U18.8(Y1) U19.1(1A)
ZSRC: U17.4(D1) U22.4(Y1)
Unconnected: J1.A20 J1.A21 J1.A22 J1.A23 J1.A25 J1.B4 J1.B6 J1.B8 J1.B10 J1.B12 J1.B14 J1.B16 J1.B18 J1.B20 J1.B22 J1.B24 J1.B26 J1.B29 J1.B30 J1.C3 J1.C4 J1.C5 J1.C6 J1.C7 J1.C8 J1.C9 J1.C10 J1.C11 J1.C12 J1.C13 J1.C14 J1.C15 J1.C16 J1.C17 J1.C18 J1.C27 U9.14(AEB) U9.16(CN4) U10.14(AEB) U11.7(!P) U11.9(CNZ) U11.10(!G) U11.11(CNY) U17.3(!Q1) U17.6(!Q2) U17.11(!Q3) U17.13(D4) U17.14(!Q4) U17.15(Q4) U19.11(4Y) U20.7(Y7) U20.15(Y0) U21.7(Y7) U21.9(Y6) U21.10(Y5) U21.15(Y0) U22.9(Y3) U22.10(B3) U22.11(A3) U22.12(Y4) U22.13(B4) U22.14(A4) U24.8(3Y) U24.11(4Y) U26.6(!1Q) U26.8(!2Q) U26.9(2Q) U28.5(A2) U28.6(B2) U28.7(Y2) U28.9(Y3) U28.10(B3) U28.11(A3) U28.12(Y4) U28.13(B4) U28.14(A4) U29.5(A2) U29.6(B2) U29.7(Y2) U29.9(Y3) U29.10(B3) U29.11(A3) U29.12(Y4) U29.13(B4) U29.14(A4) U30.5(A2) U30.6(B2) U30.7(Y2) U30.9(Y3) U30.10(B3) U30.11(A3) U30.12(Y4) U30.13(B4) U30.14(A4) U31.11(4Y) U35.6(2Y) U35.8(3Y) U35.11(4Y)

## Notes on the sheet
- A REG | A OUT | B REG | B OUT
- 74HCT377 | 74HCT244 | 74HCT377 | 74HCT244
- P8X ALU CARD REV B (conventional carry, LDZN, SETC/CLRC, carry-coupled shifter)
- T REG | T OUT | T2 REG | T2 OUT
- 74HCT377 | 74HCT244 | 74HCT377 | 74HCT244
- ALU LO | ALU HI | CLA | SH1 LO
- 74HCT181 | 74HCT181 | 74HCT182 | 74HCT157
- SH1 HI | SH2 LO | SH2 HI | ALU OUT
- 74HCT157 | 74HCT157 | 74HCT157 | 74HCT244
- Z DET | DOE DEC
- 74HCT260 | 74HCT138
- DLD DEC | FLAG MUX | FLAG OUT
- 74HCT138 | 74HCT157 | 74HCT244
- C FLAG FF | BUS Z-DET | SHIFT-OUT MUX
- 74HCT74 | 74HCT260 | 74HCT157
- C-SRC MUX | SHIN MUX | CLK/FORCE GATES | B-MUX LO
- 74HCT157 | 74HCT157 | 74HCT08 | 74HCT157
- B-MUX HI | V XOR | V AND
- 74HCT157 | 74HCT86 | 74HCT08
- PWR | ALU
- GRN | GRN
- LDF
- YEL

## Library data of the parts
C1-C35 = p8x:CAP1
J1 = p8x:DIN96C
LED3-LED5 = p8x:LED
R4 R5 RP1 = p8x:RES
U1 U3 U5 U7 = p8x:74377V2
U2 U4 U6 U8 U16 U23 = p8x:74244
U9 U10 = p8x:74181
U11 = p8x:74182
U12-U15 U22 U28-U30 U32 U33 = p8x:74157
U17 = p8x:74175
U18 U27 = p8x:74260
U19 U24 U25 U31 U34 U35 = p8x:GATES14
U20 U21 = p8x:74138
U26 = p8x:7474